# Altium schematic sheet FUSE_RVP_OVP14V7.SchDoc
size A
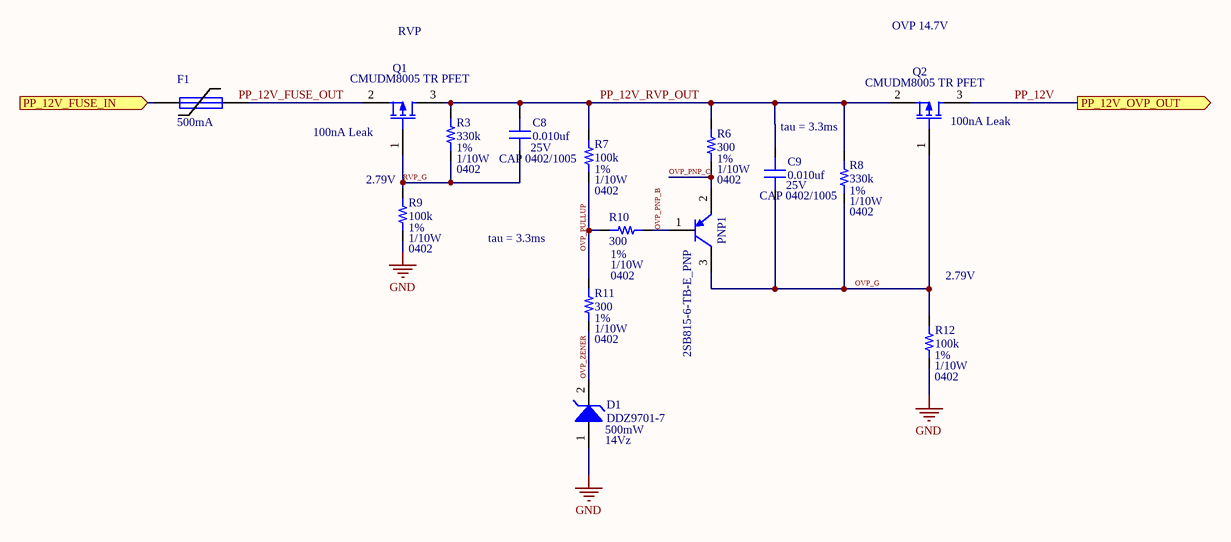
[diagram p0: FUSE_RVP_OVP14V7.SchDoc]

## Parts
C8  value 0.010uf  Voltage_Rating: 25V  [CAP 0402/1005]  (hidden comment: Capacitor MLCC 0.010uf 25V CAP 0402/1005)
C9  value 0.010uf  Voltage_Rating: 25V  [CAP 0402/1005]  (hidden comment: Capacitor MLCC 0.010uf 25V CAP 0402/1005)
D1  DDZ9701-7  value 14Vz  Power: 500mW  [SOD123F]
F1  I_hold: 500mA  [PIN-W2/E2.8]  (hidden comment: 1A)
PNP1  2SB815-6-TB-E_PNP  [SOT23-3]
Q1  CMUDM8005 TR PFET  [CMUDM8005 TR SOT523]
Q2  CMUDM8005 TR PFET  [CMUDM8005 TR SOT523]
R3  value 330k  Tolerance: 1%  Power: 1/10W  Package: 0402  [RES 0402/1005]  (hidden comment: Resistor 330k 0402 1/10W 1%)
R6  value 300  Tolerance: 1%  Power: 1/10W  Package: 0402  [RES 0402/1005]  (hidden comment: Resistor 300 0402 1/10W 1%)
R7  value 100k  Tolerance: 1%  Power: 1/10W  Package: 0402  [RES 0402/1005]  (hidden comment: Resistor 100k 0402 1/10W 1%)
R8  value 330k  Tolerance: 1%  Power: 1/10W  Package: 0402  [RES 0402/1005]  (hidden comment: Resistor 330k 0402 1/10W 1%)
R9  value 100k  Tolerance: 1%  Power: 1/10W  Package: 0402  [RES 0402/1005]  (hidden comment: Resistor 100k 0402 1/10W 1%)
R10  value 300  Tolerance: 1%  Power: 1/10W  Package: 0402  [RES 0402/1005]  (hidden comment: Resistor 300 0402 1/10W 1%)
R11  value 300  Tolerance: 1%  Power: 1/10W  Package: 0402  [RES 0402/1005]  (hidden comment: Resistor 300 0402 1/10W 1%)
R12  value 100k  Tolerance: 1%  Power: 1/10W  Package: 0402  [RES 0402/1005]  (hidden comment: Resistor 100k 0402 1/10W 1%)

## Ports
PP_12V_FUSE_IN (in), PP_12V_OVP_OUT (out)

## Nets
GND: D1.1(A) R9.1 R12.1
OVP_G: C9.1 PNP1.3(C) Q2.1(G) R8.1 R12.2
OVP_PNP_B: PNP1.1(B) R10.1
OVP_PNP_C: PNP1.2(E) R6.1
OVP_PULLUP: R7.1 R10.2 R11.2
OVP_ZENER: D1.2(K) R11.1
PP_12V: Q2.3(D) ; port PP_12V_OVP_OUT
PP_12V_FUSE_IN: F1.1 ; port PP_12V_FUSE_IN
PP_12V_RVP_OUT: C8.2 C9.2 Q1.3(D) Q2.2(S) R3.2 R6.2 R7.2 R8.2
RVP_G: C8.1 Q1.1(G) R3.1 R9.2
NetF1_2: F1.2 Q1.2(S)

## Notes on the sheet
- RVP
- OVP 14.7V
- (near Q1) 100nA Leak
- tau = 3.3ms
- (near Q2) 100nA Leak
- (near R9) 2.79V
- (near R12) 2.79V
- Labels drawn without touching a wire or pin: PP_12V_FUSE_OUT

## Library data of the parts
C8 C9 = 457: Manufacturer_id: 1; idCapacitor: 457; Name: Cap_0.010uf_25V_CAP 0402/1005; Dielectric: Ceramic; Created_By: Nick Mah; Drawer_id: 1; Package: CAP 0402/1005; Created_Date: 10/20/2018
D1 = 10: Zener Diode 14V 500mW ±5% Surface Mount SOD-123; Manufacturer_id: 8; idDiode: 10; Drawer_id: 1; MfrPartNo: DDZ9701-7; Name: DDZ9701; Type: Zener; Num_Circuits: 1; Package: SOD-123; Link: https://www.digikey.com/product-detail/en/diodes-incorporated/DDZ9701-7/DDZ9701-7DICT-ND/3877402; ComponentLink1Description: Datasheet; ComponentLink1URL: https://www.diodes.com/assets/Datasheets/ds30410.pdf; Supplier1: Digi-Key; Supplier1PartNo: DDZ9701-7DICT-ND
F1 = 5: Fuse; Manufacturer_id: 1; MfrPartNo: 1206L050/15YR; idFuse: 5; Name: PTC Poly Fuse Resettable; I_max: 100A; V_max: 15V; Pd_Typ: 600mW; Created_By: Angel; Published: 8-Jun-2000; LatestRevisionDate: 17-Jul-2002; LatestRevisionNote: Re-released for DXP Platform.; PackageReference: PIN-W2/E2.8; Publisher: Altium Limited; PackageDescription: Thru-Hole; 2 Leads; Drawer_id: 1; I_trip: 1A; Link: https://www.digikey.com/product-detail/en/littelfuse-inc/1206L050-15YR/F3733CT-ND/2486168; Created_Date: 10/27/2018
PNP1 = 8: TRANS PNP 15V 0.7A CP; Manufacturer_id: 1; idBJT: 8; Name: 2SB815-6-TB-E PNP; Power: Null; hFE: 200-400; Created_By: None; Drawer_id: 1; Value: 15V 0.7A; Type: PNP; Num_Circuits: 1; Ic: 0.7A; Vce(Max): 15V; Package: SMT 3-CP; MfrPartNo: 2SB815-6-TB-E; Link: https://www.digikey.com/product-detail/en/on-semiconductor/2SB815-6-TB-E/2SB815-6-TB-EOSCT-ND/8538307; ComponentLink1Description: datasheet; ComponentLink1URL: https://www.onsemi.com/pub/Collateral/EN694-D.PDF; Supplier1: Digi-Key; Supplier1PartNo: 2SB815-6-TB-EOSCT-ND; Created_Date: 3/2/2019; Updated_By: Null
Q1 Q2 = 13: MOSFET P-CH 20V 650MA SOT523; Manufacturer_id: 1; idFETs: 13; Value: P_Channel; Rds_On: 360m; Vgs(typ): Null; Vgs(Max): 8V; Power(Max): 300mW; Drawer_id: 1; Name: CMUDM8005 TR PFET; Vdss: 20V; Num_Circuits: 1; Id: 650mA; Package: SOT-523; MfrPartNo: CMUDM8005 TR; Link: https://www.digikey.com/product-detail/en/central-semiconductor-corp/CMUDM8005-TR/CMUDM8005CT-ND/5324590; ComponentLink1Description: datasheet; ComponentLink1URL: https://my.centralsemi.com/get_document.php?cmp=1&mergetype=pd&mergepath=pd&pdf_id=CMUDM8005.PDF; Supplier1: Digi-Key; Supplier1PartNo: CMUDM8005CT-ND; Created_By: Null; Created_Date: 3/2/2019; Updated_By: Null
R3 R8 = 133: Manufacturer_id: 1; idResistor: 133; Name: Res_330k_0402_1/10W_1%; Created_By: Nick Mah; Supplier 1: Digi-Key; Drawer_id: 1; ComponentLink1Description: Datasheet; Created_Date: 2018-10-20
R6 R10 R11 = 60: Manufacturer_id: 1; idResistor: 60; Name: Res_300_0402_1/10W_1%; Created_By: Nick Mah; Supplier 1: Digi-Key; Drawer_id: 1; ComponentLink1Description: Datasheet; Created_Date: 2018-10-20
R7 R9 R12 = 121: Manufacturer_id: 1; idResistor: 121; Name: Res_100k_0402_1/10W_1%; Created_By: Nick Mah; Supplier 1: Digi-Key; Drawer_id: 1; ComponentLink1Description: Datasheet; Created_Date: 2018-10-20